# Altium schematic sheet CPU.SchDoc
size A4; SheetNumber: 2; SheetTotal: 4
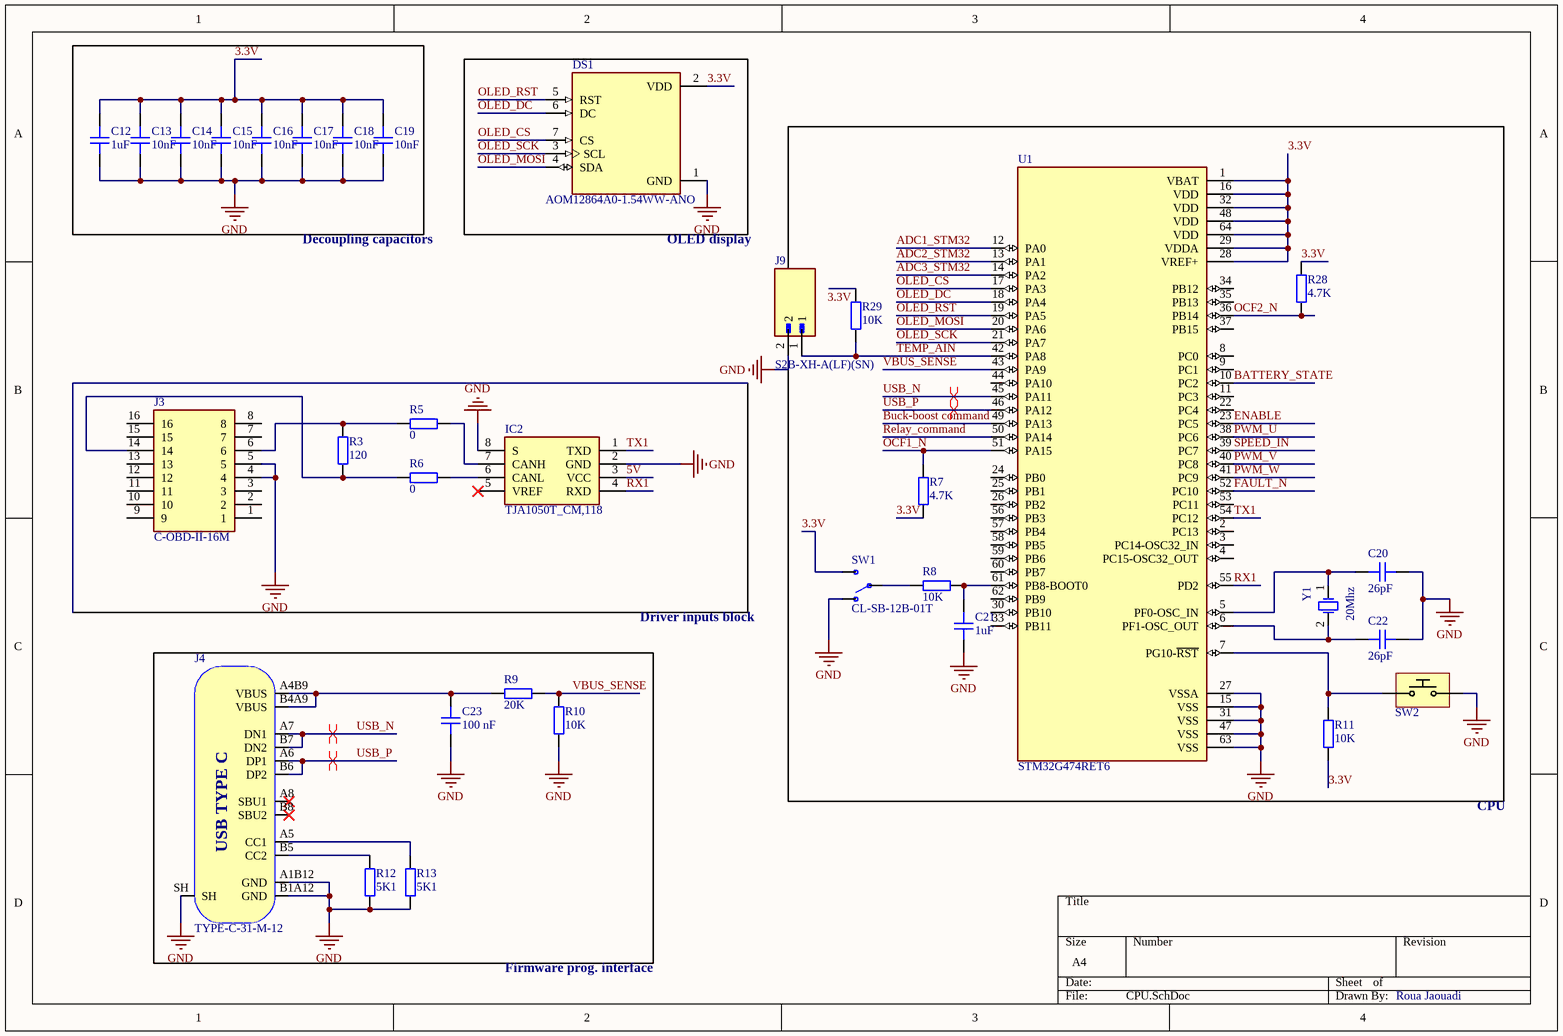
[diagram p0: CPU.SchDoc]

## Parts
C12  1uF  [CAP_0603]
C13  10nF  [CAP_0603]
C14  10nF  [CAP_0603]
C15  10nF  [CAP_0603]
C16  10nF  [CAP_0603]
C17  10nF  [CAP_0603]
C18  10nF  [CAP_0603]
C19  10nF  [CAP_0603]
C20  26pF  [CAP_0603]
C21  1uF  [CAP_0603]
C22  26pF  [CAP_0603]
C23  100 nF  [CAP_0603]
DS1  AOM12864A0-1.54WW-ANO  [LCD_AOM12864A0-1.54WW-ANO]
IC2  TJA1050T_CM,118  [SOIC127P600X175-8N]
J3  C-OBD-II-16M  [COMTECH_C-OBD-II-16M]
J4  TYPE-C-31-M-12  [TYPE-C-31-M-12]
J9  S2B-XH-A(LF)(SN)  [JST_S2B-XH-A(LF)(SN)]
R3  120  [RES_0603]
R5  0  [RES_0603]
R6  0  [RES_0603]
R7  4.7K  [RES_0402]
R8  10K  [RES_0402]
R9  20K  [RES_0402]
R10  10K  [RES_0402]
R11  10K  [RES_0402]
R12  5K1  [RES_0402]
R13  5K1  [RES_0402]
R28  4.7K  [RES_0402]
R29  10K  [RES_0402]
SW1  CL-SB-12B-01T  [CL-SB-12B-01T]
SW2  Tactile Switch  [PTS815]  (value not drawn)
U1  STM32G474RET6  [QFP50P1200X1200X160-64N]
Y1  20Mhz  [WE-XTAL_HC49/4HSMX]

## Nets
GND: C12.2 C13.2 C14.2 C15.2 C16.2 C17.2 C18.2 C19.2 C20.2 C21.2 C22.2 C23.2 DS1.1(GND) IC2.2(GND) IC2.8(S) J3.4 J3.5 J4.A1B12(GND) J4.B1A12(GND) J4.SH J9.2 R10.2 R12.2 R13.2 SW1.1 SW2.2 U1.15(VSS) U1.27(VSSA) U1.31(VSS) U1.47(VSS) U1.63(VSS)
3.3V: C12.1 C13.1 C14.1 C15.1 C16.1 C17.1 C18.1 C19.1 DS1.2(VDD) R7.2 R11.2 R28.1 R29.2 SW1.3 U1.1(VBAT) U1.16(VDD) U1.28(VREF+) U1.29(VDDA) U1.32(VDD) U1.48(VDD) U1.64(VDD)
5V: IC2.3(VCC)
ADC1_STM32: U1.12(PA0)
ADC2_STM32: U1.13(PA1)
ADC3_STM32: U1.14(PA2)
BATTERY_STATE: U1.10(PC2)
Buck-boost command: U1.49(PA13)
ENABLE: U1.23(PC5)
FAULT_N: U1.52(PC10)
OCF1_N: R7.1 U1.51(PA15)
OCF2_N: R28.2 U1.36(PB14)
OLED_CS: DS1.7(CS) U1.17(PA3)
OLED_DC: DS1.6(DC) U1.18(PA4)
OLED_MOSI: DS1.4(SDA) U1.20(PA6)
OLED_RST: DS1.5(RST) U1.19(PA5)
OLED_SCK: DS1.3(SCL) U1.21(PA7)
PWM_U: U1.38(PC6)
PWM_V: U1.40(PC8)
PWM_W: U1.41(PC9)
Relay_command: U1.50(PA14)
RX1: IC2.4(RXD) U1.55(PD2)
SPEED_IN: U1.39(PC7)
TEMP_AIN: J9.1 R29.1 U1.42(PA8)
TX1: IC2.1(TXD) U1.54(PC12)
USB_N: J4.A7(DN1) J4.B7(DN2) U1.45(PA11)
USB_P: J4.A6(DP1) J4.B6(DP2) U1.46(PA12)
VBUS_SENSE: R9.2 R10.1 U1.43(PA9)
NetC20_1: C20.1 U1.5(PF0-OSC_IN) Y1.1(OSC1)
NetC21_1: C21.1 R8.2 U1.61(PB8-BOOT0)
NetC22_1: C22.1 U1.6(PF1-OSC_OUT) Y1.2(OSC2)
NetC23_1: C23.1 J4.A4B9(VBUS) J4.B4A9(VBUS) R9.1
NetIC2_6: IC2.6(CANL) R6.2
NetIC2_7: IC2.7(CANH) R5.2
NetJ3_6: J3.6 R3.1 R5.1
NetJ3_14: J3.14 R3.2 R6.1
NetJ4_A5: J4.A5(CC1) R13.1
NetJ4_B5: J4.B5(CC2) R12.1
NetR8_1: R8.1 SW1.C
NetR11_1: R11.1 SW2.1 U1.7(PG10-~{RST})

Not connected (* = marked no-connect by the designer): IC2 5(VREF)*; J3 1 2 3 7 8 9 10 11 12 13 15 16; J4 A8(SBU1)* B8(SBU2)*; U1 2(PC13) 3(PC14-OSC32_IN) 4(PC15-OSC32_OUT) 8(PC0) 9(PC1) 11(PC3) 22(PC4) 24(PB0) 25(PB1) 26(PB2) 30(PB10) 33(PB11) 34(PB12) 35(PB13) 37(PB15) 44(PA10) 53(PC11) 56(PB3) 57(PB4) 58(PB5) 59(PB6) 60(PB7) 62(PB9)

## Layout directives
differential pair: USB_N, USB_P

## Notes on the sheet
- Decoupling capacitors
- (near DS1) OLED display
- Driver inputs block
- CPU
- Firmware prog. interface
- Roua Jaouadi
- (in symbol TYPE-C-31-M-12) USB TYPE C

## Library data of the parts
C12-C23 = CAP_0603: Capacitor SMD 0603; Manufacturer: *; Manufacturer Part Number: *; Distributor Link: *; LCSC: *; Rating: *; Dielectric: *
DS1 = AOM12864A0-1.54WW-ANO: Non-Touch Graphic LCD Display Module - White OLED SPI 1.54 (39.12mm) 128 x 64; MF: Orient Display; SnapEDA_Link: https://www.snapeda.com/parts/AOM12864A0-1.54WW-ANO/Orient+Display/view-part/?ref=snap; Package: None; Value: *; MP: AOM12864A0-1.54WW-ANO; Check_prices: https://www.snapeda.com/parts/AOM12864A0-1.54WW-ANO/Orient+Display/view-part/?ref=eda
IC2 = TJA1050T_CM,118: Integrated Circuit; Manufacturer_Name: NXP; Manufacturer_Part_Number: TJA1050T/CM,118; Datasheet Link: http://www.nxp.com/docs/en/data-sheet/TJA1050.pdf; Height: 1.75mm; Mouser Part Number: 771-TJA1050T/CM118; Mouser Price/Stock: https://www.mouser.co.uk/ProductDetail/NXP-Semiconductors/TJA1050T-CM118?qs=5XOdhvmYM0NFFspw0VP5sA%3D%3D; Arrow Part Number: TJA1050T/CM,118; Arrow Price/Stock: https://www.arrow.com/en/products/tja1050tcm118/nxp-semiconductors?utm_currency=USD&region=europe
J3 = C-OBD-II-16M: OBD II 16pin 90 Degree Angle Male Plug Connector; MF: Comtech Electronic Co., LTD; SnapEDA_Link: https://www.snapeda.com/parts/C-OBD-II-16M/Comtech+Electronic+Co.%252C+LTD/view-part/?ref=snap; Package: None; Value: *; MP: C-OBD-II-16M; Check_prices: https://www.snapeda.com/parts/C-OBD-II-16M/Comtech+Electronic+Co.%252C+LTD/view-part/?ref=eda
J4 = TYPE-C-31-M-12: USB Type C Connector Horizontal SMT; Manufacturer: Koren Hroparts; Manufacturer Part Number: TYPE-C-31-M-12
J9 = S2B-XH-A(LF)(SN): Connector Header Through Hole, Right Angle 2 position 0.098 (2.50mm); MF: JST Sales; SnapEDA_Link: https://www.snapeda.com/parts/S2B-XH-A(LF)(SN)/JST/view-part/?ref=snap; Package: None; Value: *; MP: S2B-XH-A(LF)(SN); Check_prices: https://www.snapeda.com/parts/S2B-XH-A(LF)(SN)/JST/view-part/?ref=eda
R3 R5 R6 = RES_0603: Resistor SMD 0603; Manufacturer: *; Manufacturer Part Number: *; Distributor Link: *; LCSC: *
R7-R13 R28 R29 = RES_0402: Resistor SMD 0402; Manufacturer: *; Manufacturer Part Number: *; Distributor Link: *; LCSC: *
SW1 = CL-SB-12B-01T: Slide Switch SPDT Surface Mount; MF: Nidec Copal; SnapEDA_Link: https://www.snapeda.com/parts/CL-SB-12B-01T/Nidec/view-part/?ref=snap; Package: None; Value: *; MP: CL-SB-12B-01T; Check_prices: https://www.snapeda.com/parts/CL-SB-12B-01T/Nidec/view-part/?ref=eda
SW2 = PTS815-SJM-250-SMTR-LFS: Tactile Switches Tact Switch, 12 VDC, 50 mA, 4.2x3.2, 2.5mm H, 180gf, J leadspp SPST; Manufacturer: C&K Switches; Manufacturer Part Number: PTS815 SJM 250 SMTR LFS
U1 = STM32G474RET6: ARMÂ® CortexÂ®-M4F STM32G4 Microcontroller IC 32-Bit Single-Core 170MHz 512KB (512K x 8) FLASH 64-LQFP (10x10); MF: STMicroelectronics; SnapEDA_Link: https://www.snapeda.com/parts/STM32G474RET6/STMicroelectronics/view-part/?ref=snap; Package: LQFP-64 STMicroelectronics; Value: *; MP: STM32G474RET6; Check_prices: https://www.snapeda.com/parts/STM32G474RET6/STMicroelectronics/view-part/?ref=eda
Y1 = 830003260: WE-XTAL Quartz Crystal, SMT, HC49/4HSMX, 3.6864 MHz, ±30ppm; Manufacturer: Wurth Elektronik; Frequency Stability: 50ppm; Load Capacitance: 16pF; Manufacturer Part Number: 830003260; Category: Crystals; Match Code: WE-XTAL; ComponentLink1Description: Website Link; ComponentLink1URL: https://www.we-online.com/redexpert/article/830003260?ad; ComponentLink2Description: Datasheet Link; ComponentLink2URL: https://www.we-online.com/redexpert/spec/830003260?ad; Mount: Surface Mount; Min Operating Temperature: -10°C; Max Operating Temperature: 60°C; Packaging: Tape and Reel; Case/Size Code: HC49/4HSMX; Length: 12.4mm; Width: 4.7mm; Height: 4.5mm; Application: Processor, UART; Frequency: 3.6864 MHz; Frequency Tolerance: ±30ppm